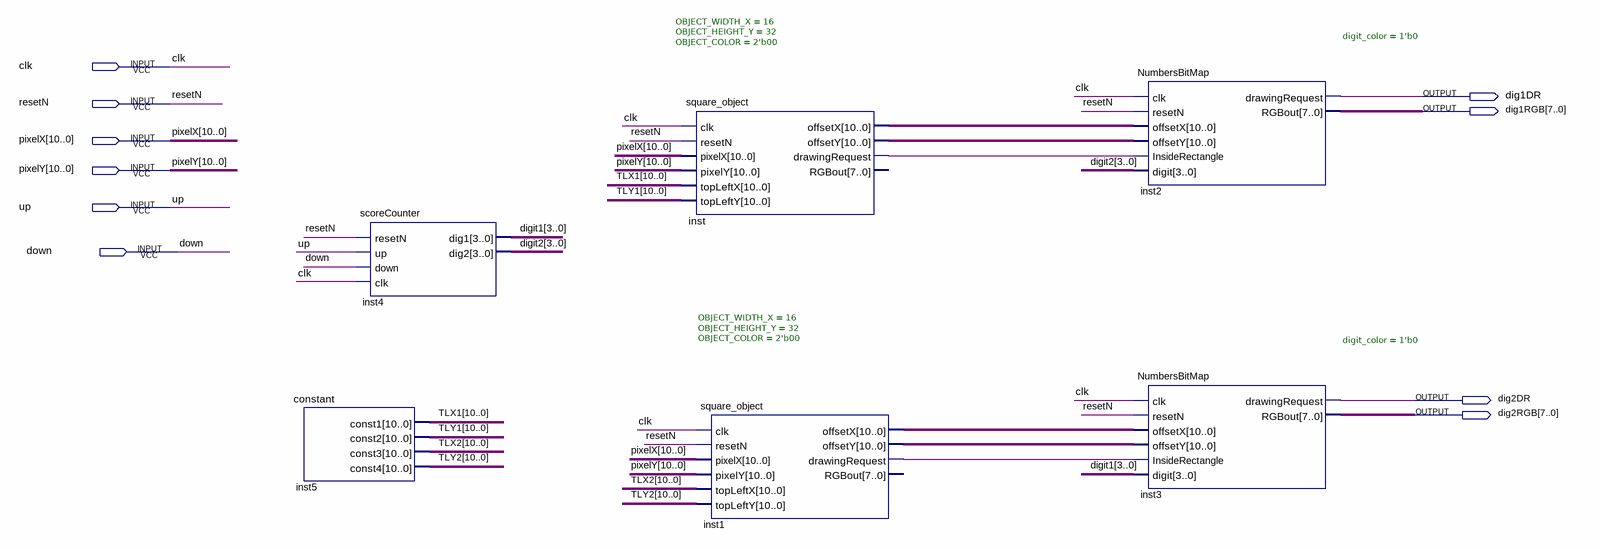
[diagram p0: schematic sheet]
// Quartus schematic SCOREBOARD.bdf as structural Verilog: 6 symbols, 10 pins
module SCOREBOARD (
  input  clk,
  input  resetN,
  input  [10:0] pixelX,
  input  [10:0] pixelY,
  input  up,
  input  down,
  output dig1DR,
  output [7:0] dig1RGB,
  output dig2DR,
  output [7:0] dig2RGB
);

  wire inst1_drawingrequest, inst_drawingrequest;
  wire [3:0] digit1, digit2;
  wire [10:0] inst1_offsetx, inst1_offsety, inst_offsetx, inst_offsety, TLX1, TLX2, TLY1, TLY2;

  constant inst5 (.const1(TLX1), .const2(TLY1), .const3(TLX2), .const4(TLY2));
  scoreCounter inst4 (.resetN(resetN), .up(up), .down(down), .clk(clk), .dig1(digit1), .dig2(digit2));
  square_object #(.OBJECT_WIDTH_X(16), .OBJECT_HEIGHT_Y(32), .OBJECT_COLOR(2'b00)) inst (
    .clk(clk), .resetN(resetN), .pixelX(pixelX), .pixelY(pixelY), .topLeftX(TLX1), .topLeftY(TLY1),
    .offsetX(inst_offsetx), .offsetY(inst_offsety), .drawingRequest(inst_drawingrequest));  // open: RGBout
  square_object #(.OBJECT_WIDTH_X(16), .OBJECT_HEIGHT_Y(32), .OBJECT_COLOR(2'b00)) inst1 (
    .clk(clk), .resetN(resetN), .pixelX(pixelX), .pixelY(pixelY), .topLeftX(TLX2), .topLeftY(TLY2),
    .offsetX(inst1_offsetx), .offsetY(inst1_offsety), .drawingRequest(inst1_drawingrequest));  // open: RGBout
  NumbersBitMap #(.digit_color(1'b0)) inst2 (
    .clk(clk), .resetN(resetN), .offsetX(inst_offsetx), .offsetY(inst_offsety),
    .InsideRectangle(inst_drawingrequest), .digit(digit2), .drawingRequest(dig1DR), .RGBout(dig1RGB));
  NumbersBitMap #(.digit_color(1'b0)) inst3 (
    .clk(clk), .resetN(resetN), .offsetX(inst1_offsetx), .offsetY(inst1_offsety),
    .InsideRectangle(inst1_drawingrequest), .digit(digit1), .drawingRequest(dig2DR), .RGBout(dig2RGB));
endmodule
